# Altium schematic sheet Transformer.SchDoc
size A
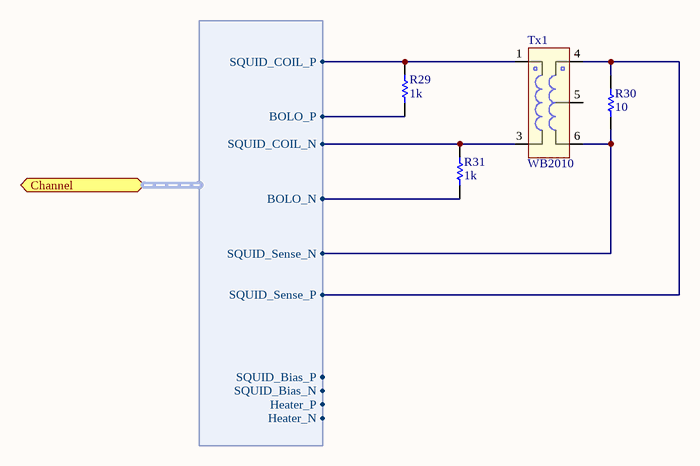
[diagram p0: Transformer.SchDoc]

## Parts
R29  1k  [0603]
R30  10  [0603]
R31  1k  [0603]
Tx1  WB2010  [WB2010]

## Ports
Channel (harness SQUID_CH_IN)

## Harnesses
SQUID_CH_IN: SQUID_COIL_P, SQUID_COIL_N, BOLO_P, BOLO_N, SQUID_Sense_P, SQUID_Bias_P, SQUID_Bias_N, Heater_P, SQUID_Sense_N, Heater_N

## Nets
NetR29_1: R29.1 ; port Channel.BOLO_P
NetR29_2: R29.2 Tx1.1 ; port Channel.SQUID_COIL_P
NetR30_1: R30.1 Tx1.6 ; port Channel.SQUID_Sense_N
NetR30_2: R30.2 Tx1.4 ; port Channel.SQUID_Sense_P
NetR31_1: R31.1 ; port Channel.BOLO_N
NetR31_2: R31.2 Tx1.3 ; port Channel.SQUID_COIL_N

Not connected (* = marked no-connect by the designer): Tx1 5

## Library data of the parts
R29 R31 = RES 0603: 1k RES 0603; Manufacturer: Vishay Dale; Part Constraints: RES 1k OHM 1/10W 1% 0603 SMD; Manufacturer Part Number: CRCW06031K00FKEA; Assembly Comments: none; Value: 1k; Cost: $0.124; Supplier: Digikey; Supplier Part Number: 541-1.00KHCT-ND; Type: SMD
R30 = RES 0603: 10 Ohm RES 0603; Manufacturer: Vishay Dale; Part Constraints: RES 10 OHM 1/10W 1% 0603 SMD; Manufacturer Part Number: CRCW060310R0FKEA; Assembly Comments: none; Value: 10; Cost: $0.124; Supplier: Digikey; Supplier Part Number: 541-10.0HCT-ND; Type: SMD
Tx1 = WB2010: WB2010 1:1 Transformer; Manufacturer: Coilcraft; Manufacturer Part Number: WB2010-SMLB; Assembly Comments: none; Value: WB2010-SMLB; Supplier: Coilcraft; Cost: $4.16; Part Constraints: WB2010-SMLB; Supplier Part Number: WB2010-SMLB; Type: SMD